# EAGLE schematic FM-Radio (EAGLE 8.0.1)

## Sheet 1 of 2
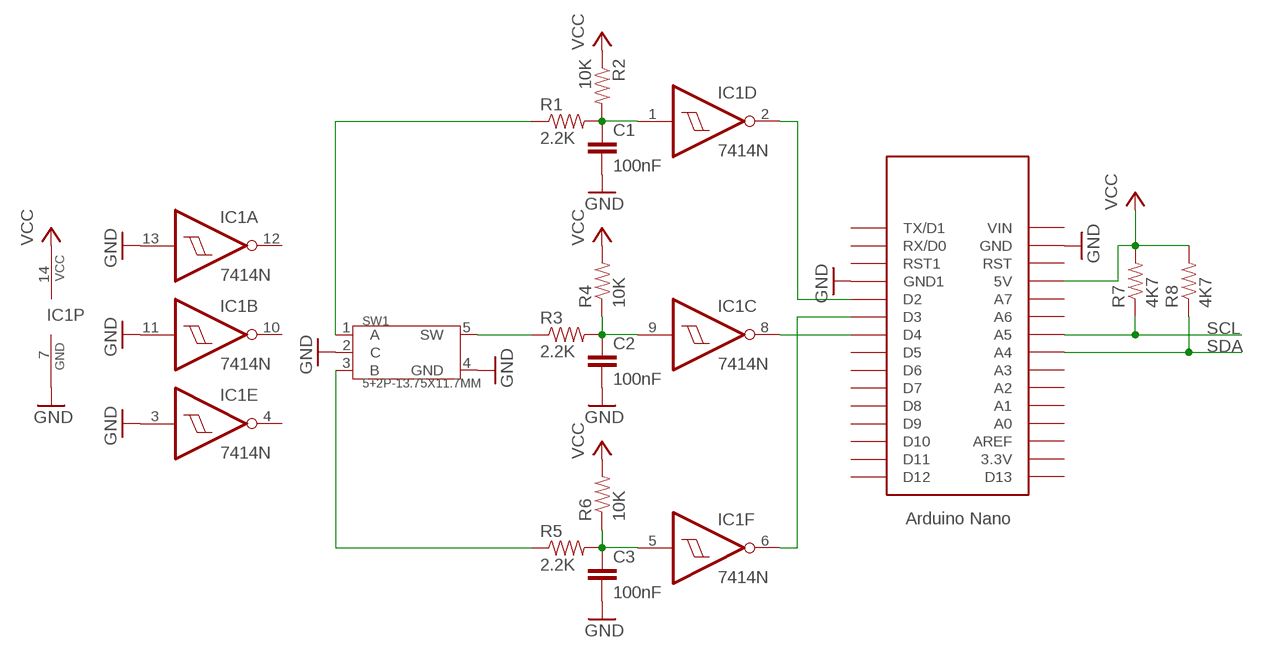
[diagram p0: schematic, sheet 1]

### Parts
C1  100nF  CAPACITOR-5MM  [CAPACITOR-5MM]
C2  100nF  CAPACITOR-5MM  [CAPACITOR-5MM]
C3  100nF  CAPACITOR-5MM  [CAPACITOR-5MM]
IC1  7414N  [DIL14]
IC2  ARDUINO-NANO  [ARDUINO-NANO]
R1  2.2K  RESISTOR-7.5MM  [AXIAL-7.5MM]
R2  10K  RESISTOR-7.5MM  [AXIAL-7.5MM]
R3  2.2K  RESISTOR-7.5MM  [AXIAL-7.5MM]
R4  10K  RESISTOR-7.5MM  [AXIAL-7.5MM]
R5  2.2K  RESISTOR-7.5MM  [AXIAL-7.5MM]
R6  10K  RESISTOR-7.5MM  [AXIAL-7.5MM]
R7  4K7  RESISTOR-7.5MM  [AXIAL-7.5MM]
R8  4K7  RESISTOR-7.5MM  [AXIAL-7.5MM]
SW1  5+2P-13.75X11.7MM  ROTARY-ENCODER-SW  [ROTARY-ENCODER-SW]

### Nets
GND: C1.2 C2.2 C3.2 IC1.3(E:I) IC1.7(P:GND) IC1.11(B:I) IC1.13(A:I) IC2.GND IC2.GND1 SW1.2(C) SW1.4(GND) ; also sheet 2
N$1: C2.1 IC1.9(C:I) R3.P$2 R4.P$1
N$2: C3.1 IC1.5(F:I) R5.P$2 R6.P$1
N$4: C1.1 IC1.1(D:I) R1.P$2 R2.P$2
ROT-A-CLEAN: IC1.2(D:O) IC2.D2
ROT-B-CLEAN: IC1.6(F:O) IC2.D3
ROTARY-A: R1.P$1 SW1.1(A)
ROTARY-B: R5.P$1 SW1.3(B)
SCL: IC2.A5 R7.P$1 ; also sheet 2
SDA: IC2.A4 R8.P$1 ; also sheet 2
SWITCH: R3.P$1 SW1.5(SW)
SWITCH-CLEAN: IC1.8(C:O) IC2.D4
VCC: IC1.14(P:VCC) IC2.5V R2.P$1 R4.P$2 R6.P$2 R7.P$2 R8.P$2 ; also sheet 2
Unconnected: IC1.4(E:O) IC1.10(B:O) IC1.12(A:O) IC2.3.3V IC2.A0 IC2.A1 IC2.A2 IC2.A3 IC2.A6 IC2.A7 IC2.AREF IC2.D5 IC2.D6 IC2.D7 IC2.D8 IC2.D9 IC2.D10 IC2.D11 IC2.D12 IC2.D13 IC2.ICSP1 IC2.ICSP2 IC2.ICSP3 IC2.ICSP4 IC2.ICSP5 IC2.ICSP6 IC2.RAW(VIN) IC2.RST IC2.RST1 IC2.RX1(RX/D0) IC2.TX0(TX/D1)

## Sheet 2 of 2
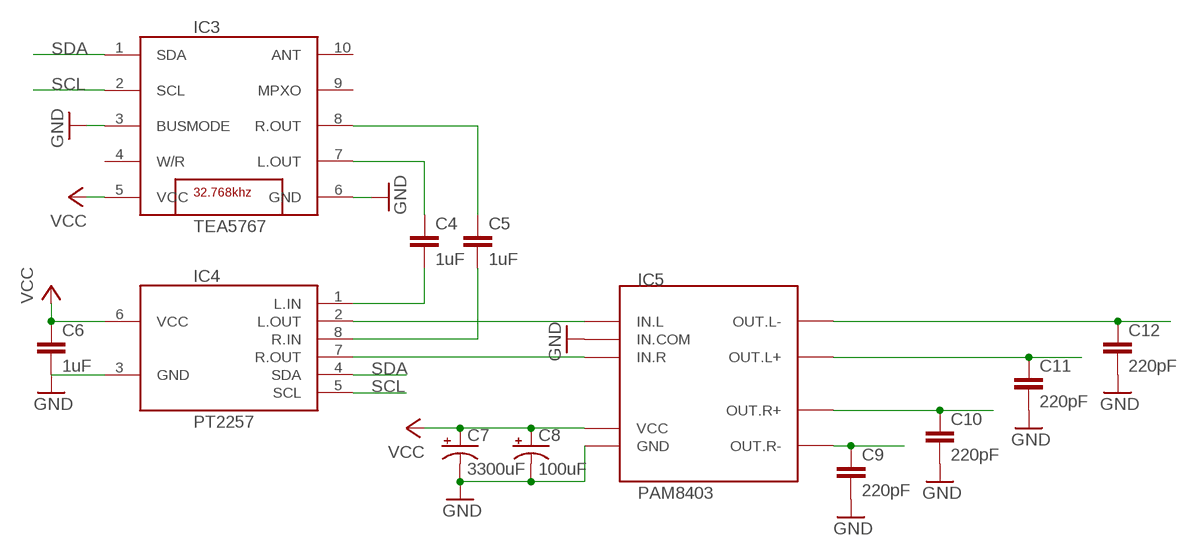
[diagram p1: schematic, sheet 2]

### Parts
C4  1uF  CAPACITOR-5MM  [CAPACITOR-5MM]
C5  1uF  CAPACITOR-5MM  [CAPACITOR-5MM]
C6  1uF  CAPACITOR-5MM  [CAPACITOR-5MM]
C7  3300uF  CAP-POL-5-8  [CAP-POL-5-8]
C8  100uF  CAP-POL-5-8  [CAP-POL-5-8]
C9  220pF  CAPACITOR-5MM  [CAPACITOR-5MM]
C10  220pF  CAPACITOR-5MM  [CAPACITOR-5MM]
C11  220pF  CAPACITOR-5MM  [CAPACITOR-5MM]
C12  220pF  CAPACITOR-5MM  [CAPACITOR-5MM]
IC3  TEA5767  [TJ-102BC]
IC4  PT2257  [DIP08]
IC5  PAM8403  [PAM8403]

### Nets
GND: C7.- C8.- C9.2 C10.2 C11.2 C12.2 IC3.3(BUSMODE) IC3.6(GND) IC4.3(GND) IC5.GND IC5.IN.COM ; also sheet 1
N$3: C5.1 IC3.8(R.OUT)
N$5: C4.1 IC3.7(L.OUT)
N$6: C5.2 IC4.8(R.IN)
N$7: C4.2 IC4.1(L.IN)
N$8: IC4.2(L.OUT) IC5.IN.L
N$9: IC4.7(R.OUT) IC5.IN.R
N$11: C12.1 IC5.OUT.L-
N$12: C11.1 IC5.OUT.L+
N$13: C9.1 IC5.OUT.R-
N$14: C10.1 IC5.OUT.R+
SCL: IC3.2(SCL) IC4.5(SCL) ; also sheet 1
SDA: IC3.1(SDA) IC4.4(SDA) ; also sheet 1
VCC: C6.1 C7.+ C8.+ IC3.5(VCC) IC4.6(VCC) IC5.+5V(VCC) ; also sheet 1
Unconnected: C6.2 IC3.4(W/R) IC3.9(MPXO) IC3.10(ANT)

## Library data of the parts
C1-C6 C9-C12 = SaintGimp:CAPACITOR-*: Ceramic Capacitor
C7 C8 = SaintGimp:CAP-POL-*: Polarized Capacitor
IC1 = 74xx-us:74*14: Hex schmitt trigger INVERTER
IC2 = SaintGimp:ARDUINO-NANO: Arduino Nano
IC3 = SaintGimp:TEA5767
IC4 = SaintGimp:PT2257
IC5 = SaintGimp:PAM8403: Stereo Class-D 3W Audio Amplifier based on PAM8403 chip
R1-R8 = SaintGimp:RESISTOR-*
SW1 = SaintGimp:ROTARY-ENCODER-SW: 311130001; MPN: Rotary-switch